# EAGLE design tps63020-buck-boost-flashlight-driver-17mm-mk-1.0.0 (EAGLE 9.2.0)
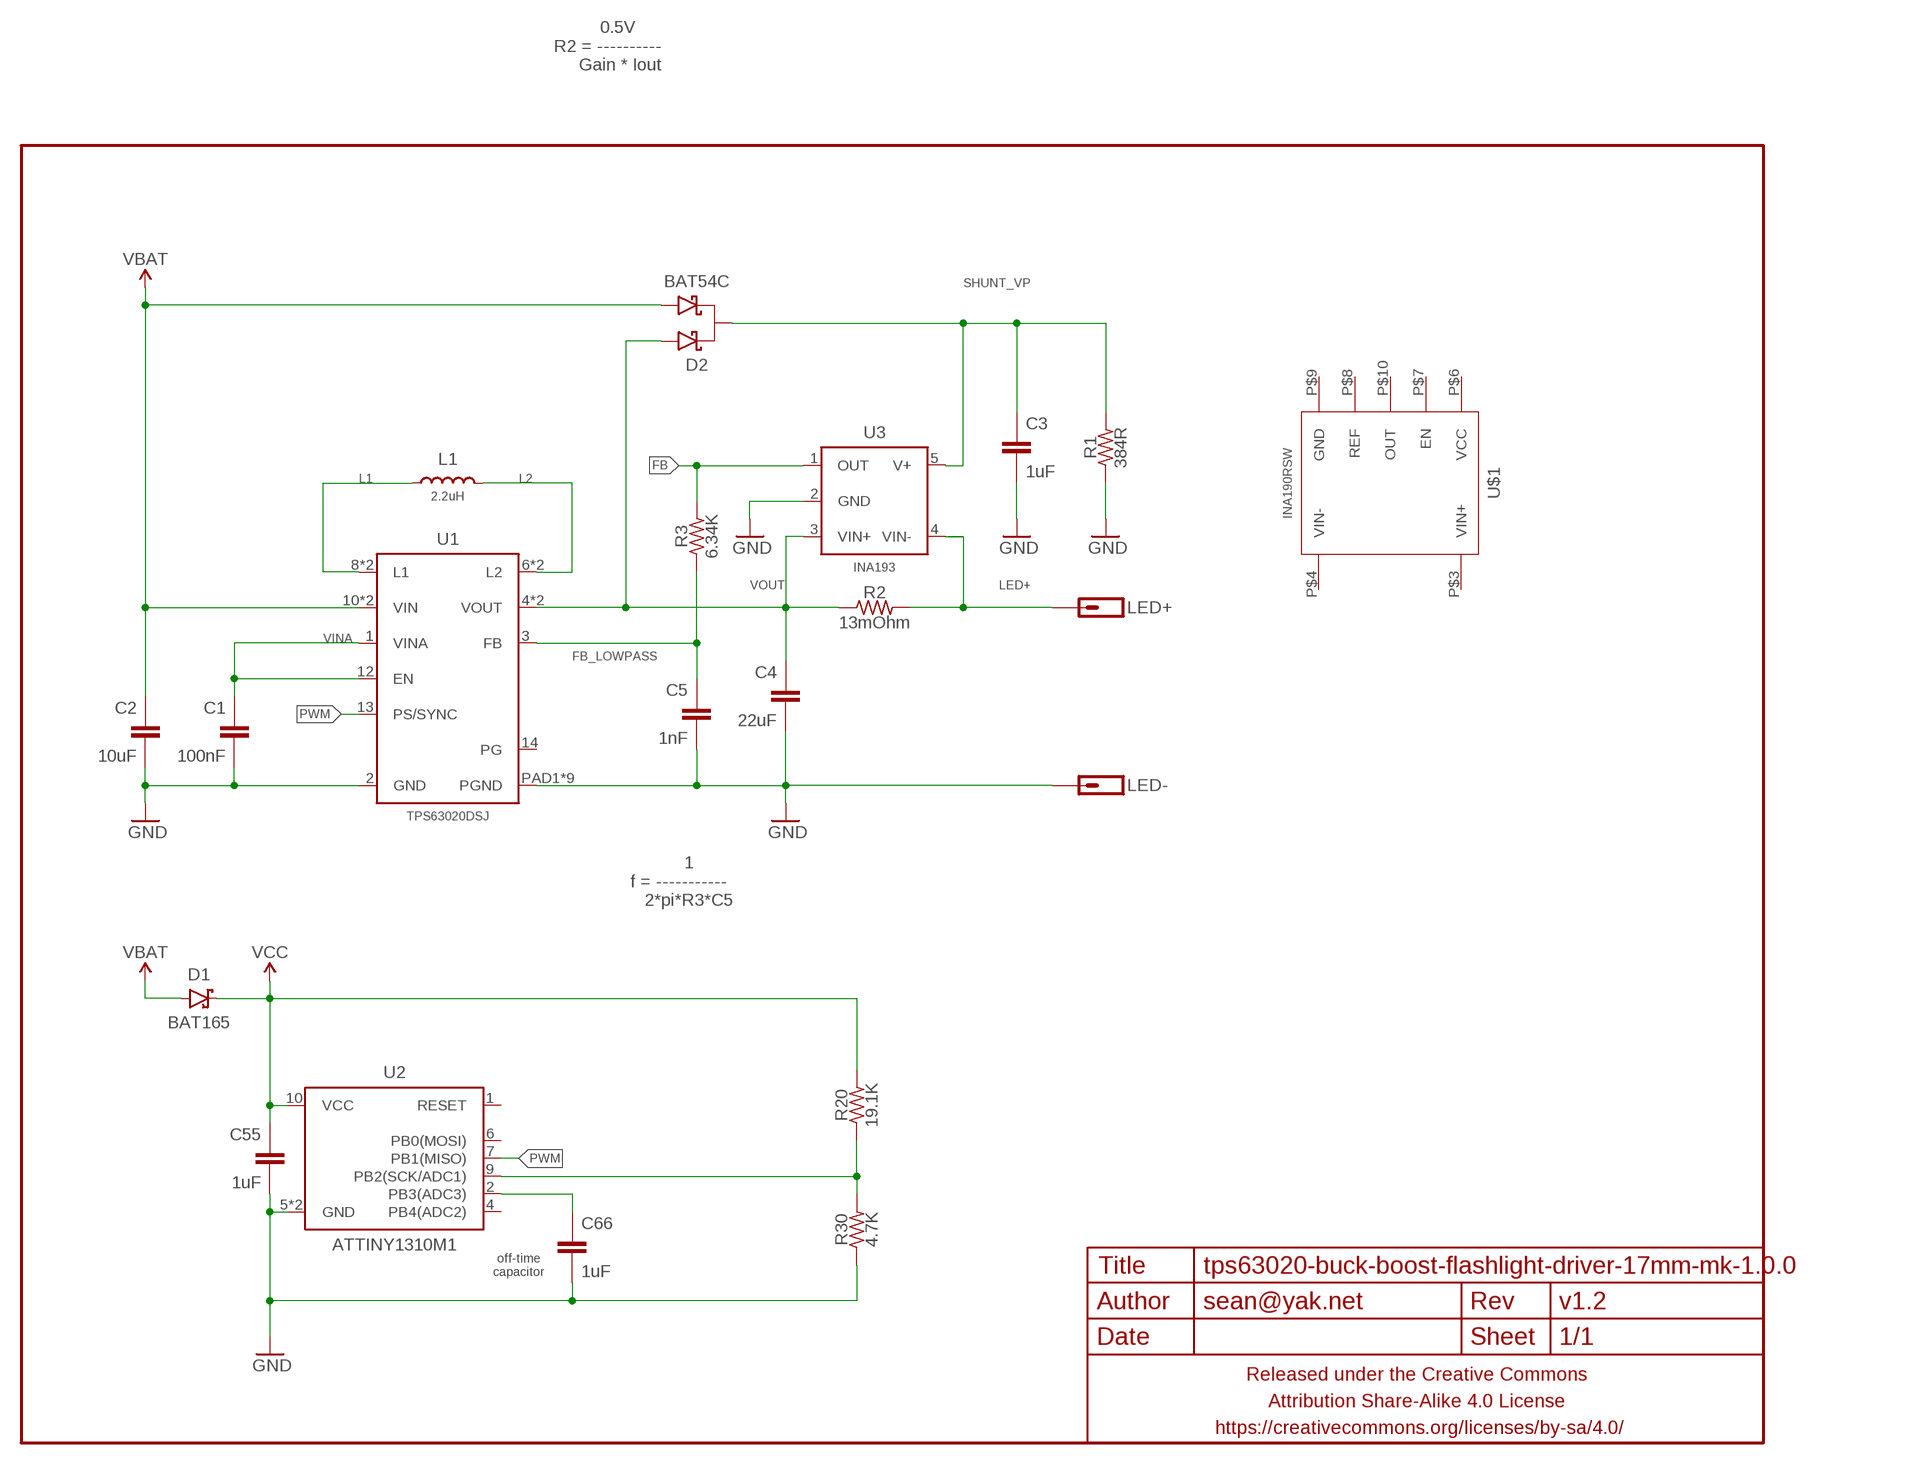
[diagram p0: schematic, sheet 1]

## Parts
C1  100nF  CAPACITOR-CERAMICC0402  [C0402]
C2  10uF  CAPACITOR-CERAMICC0603-TIGHTER  [C0603-TIGHTER]
C3  1uF  CAPACITOR-CERAMICC0402  [C0402]
C4  22uF  CAPACITOR-CERAMICC0603-TIGHTER  [C0603-TIGHTER]
C5  1nF  CAPACITOR-CERAMICC0402  [C0402]
C55  1uF  CAPACITOR-CERAMICC0603-TIGHTER  [C0603-TIGHTER]
C66  1uF  CAPACITOR-CERAMICC0402  [C0402]
D1  BAT165  DIODE-SCHOTTKYSOD323  [SOD323-SCHOTTKY]
D2  BAT54C  DIODE-SCHOTTKY-DUALBAT54C  [SOT23]
FRAME1  FRAME-LETTERNO_PACKAGE  [DUMMY]
L1  2.2uH  INDUCTORXAL50X0  [XAL50X0]
LED+  M01PTH-1MM-CIR-NS  [1X01-1MM-CIR-NS]
LED-  M01PTH-1MM-CIR-NS  [1X01-1MM-CIR-NS]
R1  384R  RESISTORR0402  [R0402]
R2  13mOhm  RESISTORR0805-TIGHTER  [R0805-TIGHTER]
R3  6.34K  RESISTORR0402  [R0402]
R20  19.1K  RESISTORR0603-TIGHTER  [R0603-TIGHTER]
R30  4.7K  RESISTORR0603-TIGHTER  [R0603-TIGHTER]
U1  TPS63020DSJ  [VSON-14-4MMX3MM]
U2  ATTINY1310M1  [QFN10(2X5)]
U3  INA193  [SOT23-5]
U$1  INA190RSW  [UQFN-10]

## Nets
FB: R3.2 U3.1(OUT)
FB_LOWPASS: C5.1 R3.1 U1.3(FB)
GND: C1.2 C2.2 C3.2 C4.2 C5.2 C55.2 C66.2 LED-.1 R1.1 R30.1 U1.2(GND) U1.PAD1(PGND) U1.PAD2(PGND) U1.PAD3(PGND) U1.PAD4(PGND) U1.PAD5(PGND) U1.PAD6(PGND) U1.PAD7(PGND) U1.PAD8(PGND) U1.PADCENTER(PGND) U2.5(GND) U2.PAD(GND) U3.2(GND)
L1: L1.P$1 U1.8(L1) U1.9(L1)
L2: L1.P$2 U1.6(L2) U1.7(L2)
LED+: LED+.1 R2.2 U3.4(VIN-)
N$3: R20.1 R30.2 U2.9(PB2(SCK/ADC1))
N$5: C66.1 U2.2(PB3(ADC3))
PWM: U1.13(PS/SYNC) U2.7(PB1(MISO))
SHUNT_VP: C3.1 D2.3(K) R1.2 U3.5(V+)
VBAT: C2.1 D1.A D2.2(A2) U1.10(VIN) U1.11(VIN)
VCC: C55.1 D1.C R20.2 U2.10(VCC)
VINA: C1.1 U1.1(VINA) U1.12(EN)
VOUT: C4.1 D2.1(A1) R2.1 U1.4(VOUT) U1.5(VOUT) U3.3(VIN+)
Unconnected: U1.14(PG) U2.1(RESET) U2.4(PB4(ADC2)) U2.6(PB0(MOSI)) U$1.P$3(VIN+) U$1.P$4(VIN-) U$1.P$6(VCC) U$1.P$7(EN) U$1.P$8(REF) U$1.P$9(GND) U$1.P$10(OUT)

## Notes on the sheet
- 0.5V
  R2 = ----------
       Gain * Iout
- 1
  f = -----------
      2*pi*R3*C5
- off-time
  capacitor

## Library data of the parts
C1-C5 C55 C66 = a_parts:CAPACITOR-CERAMIC: CAPACITOR, European symbol
D1 = a_parts:DIODE-SCHOTTKY: Schottky diodes in SFE's production catalog BAT20J 1A 23V 0.62Vf RB751 120mA 40V 0.37Vf PMEG4005EJ 0.5A 40V 0.42Vf MBRA140 1A 40V 0.5Vf B340A 3A 40V SMA
D2 = a_parts:DIODE-SCHOTTKY-DUAL
FRAME1 = a_parts:FRAME-LETTER: Schematic Frame Standard 8.5x11 US Letter frame; DESIGNER: sean@yak.net; VERSION: v1.2
L1 = a_parts:INDUCTOR: Inductors Basic Inductor/Choke - 0603 and 1206. Footprints are not proven and vary greatly between part numbers. SRN6045- 33uH, 20% 1.4A SDR0403-560KL - 56uH, 10%, 500mA RMS/740mA peak
LED+ LED- = a_parts:M01: Header 1 Standard 1-pin 0.1" header. Use with straight break away headers (SKU : PRT-00116), right angle break away headers (PRT-00553), swiss pins (PRT-00743), machine pins (PRT-00117), and female headers (PRT-00115).
R1-R3 R20 R30 = a_parts:RESISTOR: RESISTOR, American symbol
U1 = a_parts:TPS63020
U2 = a_parts:ATTINY13: Atmel 8-pin 1kB flash uC
U3 = a_parts:INA193
U$1 = a_parts:INA190

## Board
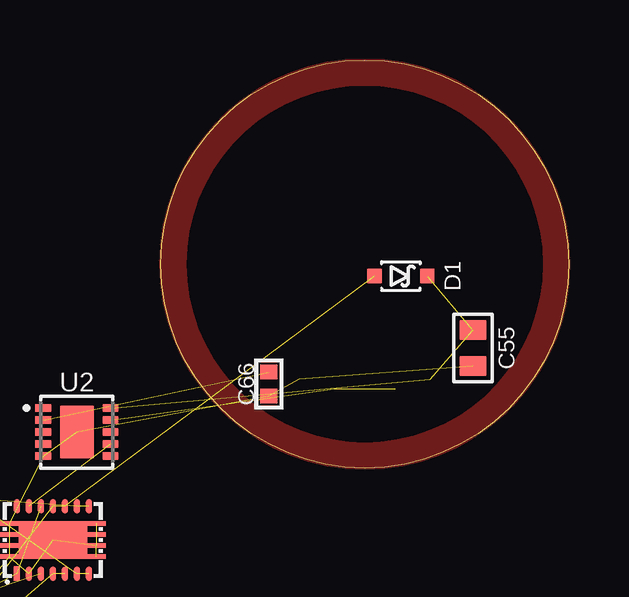
[diagram p1: board, top side]
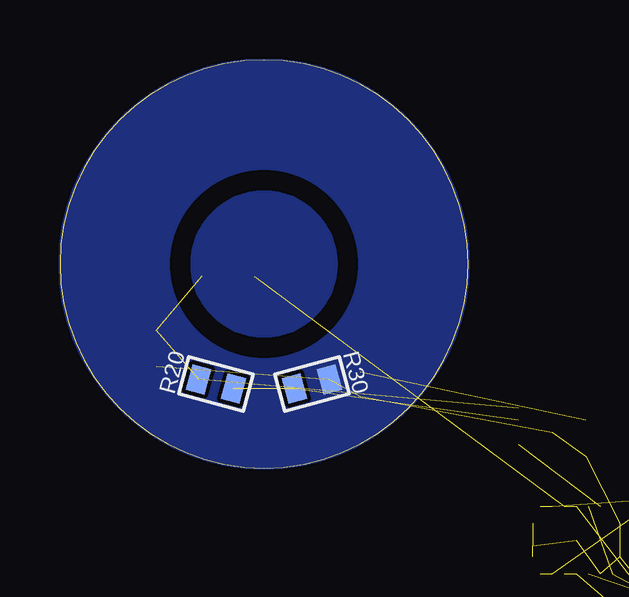
[diagram p2: board, bottom side, seen from below]

Size 17 x 17 mm. Coordinates in mm from the lower left corner, seen from the top.
Outline: 0,8.5 arc-180 17,8.5 arc-180 0,8.5
Copper layers (1*16): Top 0.0356mm / dielectric 1.5011mm / Bottom 0.0356mm
Design rules "LaenPCBOrder2 *": minimum track width 6mil, minimum drill 13mil, track to track 6mil, track to pad 6mil, pad to pad 6mil, via to via 6mil, smd to smd 6mil, copper to edge 0mil, drill to drill 6mil, minimum pad ring 7mil, minimum via ring 7mil, stop-mask expansion 3mil, vias tented up to drill 20mil, thermal gap 10mil
bRestrict: area 5,5 to 12,12

### Footprints (pad centres in the part's own frame; a part is rotated, then mirrored left to right if it is on the bottom)
C0402 = smd 0.6 x 0.7: 1 -0.5,0; 2 0.5,0
C0603-TIGHTER = smd 0.8 x 1.1: 1 -0.75,0; 2 0.75,0
SOD323-SCHOTTKY = smd 0.6 x 0.6: A -1.1,0; C 1.1,0
SOT23 = smd 1 x 1.2: 1 -0.95,-1; 2 0.95,-1; 3 0,1
XAL50X0 = smd 1.18 x 4.7: P$1 -1.651,0; P$2 1.651,0
1X01-1MM-CIR-NS = drill 1.016 pad 1.778: 1 0,0
R0402 = smd 0.6 x 0.7: 1 -0.5,0; 2 0.5,0
R0805-TIGHTER = smd 1.1 x 1.5: 1 -0.85,0; 2 0.8,0
R0603-TIGHTER = smd 0.8 x 1.1: 1 -0.75,0; 2 0.75,0
VSON-14-4MMX3MM = smd 0.24 x 0.6: 1 -1.5,-1.4; 2 -1,-1.4; 3 -0.5,-1.4; 4 0,-1.4; 5 0.5,-1.4; 6 1,-1.4; 7 1.5,-1.4; 8 1.5,1.4; 9 1,1.4; 10 0.5,1.4; 11 0,1.4; 12 -0.5,1.4; 13 -1,1.4; 14 -1.5,1.4 | smd 0.775 x 0.2: PAD1 -1.812,0.69; PAD2 -1.812,0.23; PAD3 -1.812,-0.23; PAD4 -1.812,-0.69; PAD5 1.812,-0.69; PAD6 1.812,-0.23; PAD7 1.812,0.23; PAD8 1.812,0.69 | smd 2.85 x 1.58: PADCENTER 0,0
QFN10(2X5) = smd 0.65 x 0.3: 1 -1.4,1; 2 -1.4,0.5; 3 -1.4,0; 4 -1.4,-0.5; 5 -1.4,-1; 6 1.4,-1; 7 1.4,-0.5; 8 1.4,0; 9 1.4,0.5; 10 1.4,1 | smd 1.4 x 2.2: PAD 0,0
SOT23-5 = smd 0.55 x 1.2: 1 -0.95,-1.3; 2 0,-1.3; 3 0.95,-1.3; 4 0.95,1.3; 5 -0.95,1.3
UQFN-10 = smd 0.2 x 0.8: P$1 -0.2,-0.7; P$2 0.2,-0.7; P$6 0.2,0.7; P$7 -0.2,0.7 | smd 0.8 x 0.2: P$3 0.9,-0.3; P$4 0.9,0; P$5 0.9,0.3; P$8 -0.9,0.3; P$9 -0.9,0; P$10 -0.9,-0.3

### Placement (x,y rotation side)
C1  -23.5,-14 0 top  (outside the outline)
C2  -27.5,-13.5 0 top  (outside the outline)
C3  -35,-17.5 0 top  (outside the outline)
C4  -39,-17 0 top  (outside the outline)
C5  -46.5,-17.5 0 top  (outside the outline)
C55  13,5 270 top
C66  4.5,3.5 270 top
D1  10,8 0 top
D2  -15,-13 0 top  (outside the outline)
FRAME1  0,0 0 top
L1  -10,-1 0 top  (outside the outline)
LED+  -10.5,-15 0 top  (outside the outline)
LED-  -10.5,-11.5 0 top  (outside the outline)
R1  -31.5,-14 0 top  (outside the outline)
R2  -30.5,-18.5 0 top  (outside the outline)
R3  -43,-17.5 0 top  (outside the outline)
R20  10.5,3.5 165 bottom
R30  6.5,3.5 195 bottom
U1  -4.5,-3 0 top
U2  -3.5,1.5 0 top
U3  -10,-7 0 top  (outside the outline)
U$1  -46.5,-22 0 top  (outside the outline)

### Tracks (layer width: path | path; a pad name or v marks a point on that pad's centre or on a via)
FB  (1 unrouted)
FB_LOWPASS  (2 unrouted)
GND  (22 unrouted)
  pour Top (isolate 0.152, rank 6, no thermals): 0,8.5 arc90 8.5,0 arc90 17,8.5 16,8.5 arc-90 8.5,1 arc-90 1,8.5
  pour Bottom (isolate 0.152, rank 6, no thermals): 8.5,0 arc-90 0,8.5 arc-90 8.5,17 arc-90 17,8.5 arc-90
  pour Top (isolate 0.152, rank 6, no thermals): 17,8.5 arc90 8.5,17 arc90 0,8.5 1,8.5 arc-90 8.5,16 arc-90 16,8.5
L1  (2 unrouted)
L2  (2 unrouted)
LED+  (2 unrouted)
N$3  (2 unrouted)
N$5  (1 unrouted)
PWM  (1 unrouted)
SHUNT_VP  (3 unrouted)
VBAT  (4 unrouted)
  pour Bottom (isolate 0.152, no thermals): 5.5,8.5 arc-180 11.5,8.5 arc-180
VCC  (3 unrouted)
VINA  (2 unrouted)
VOUT  (5 unrouted)

### Text on the board
bPlace: TPS63020 / Buck-Boost / Flashlight Driver